# EAGLE design WeMos-Lora (EAGLE 7.7.0)
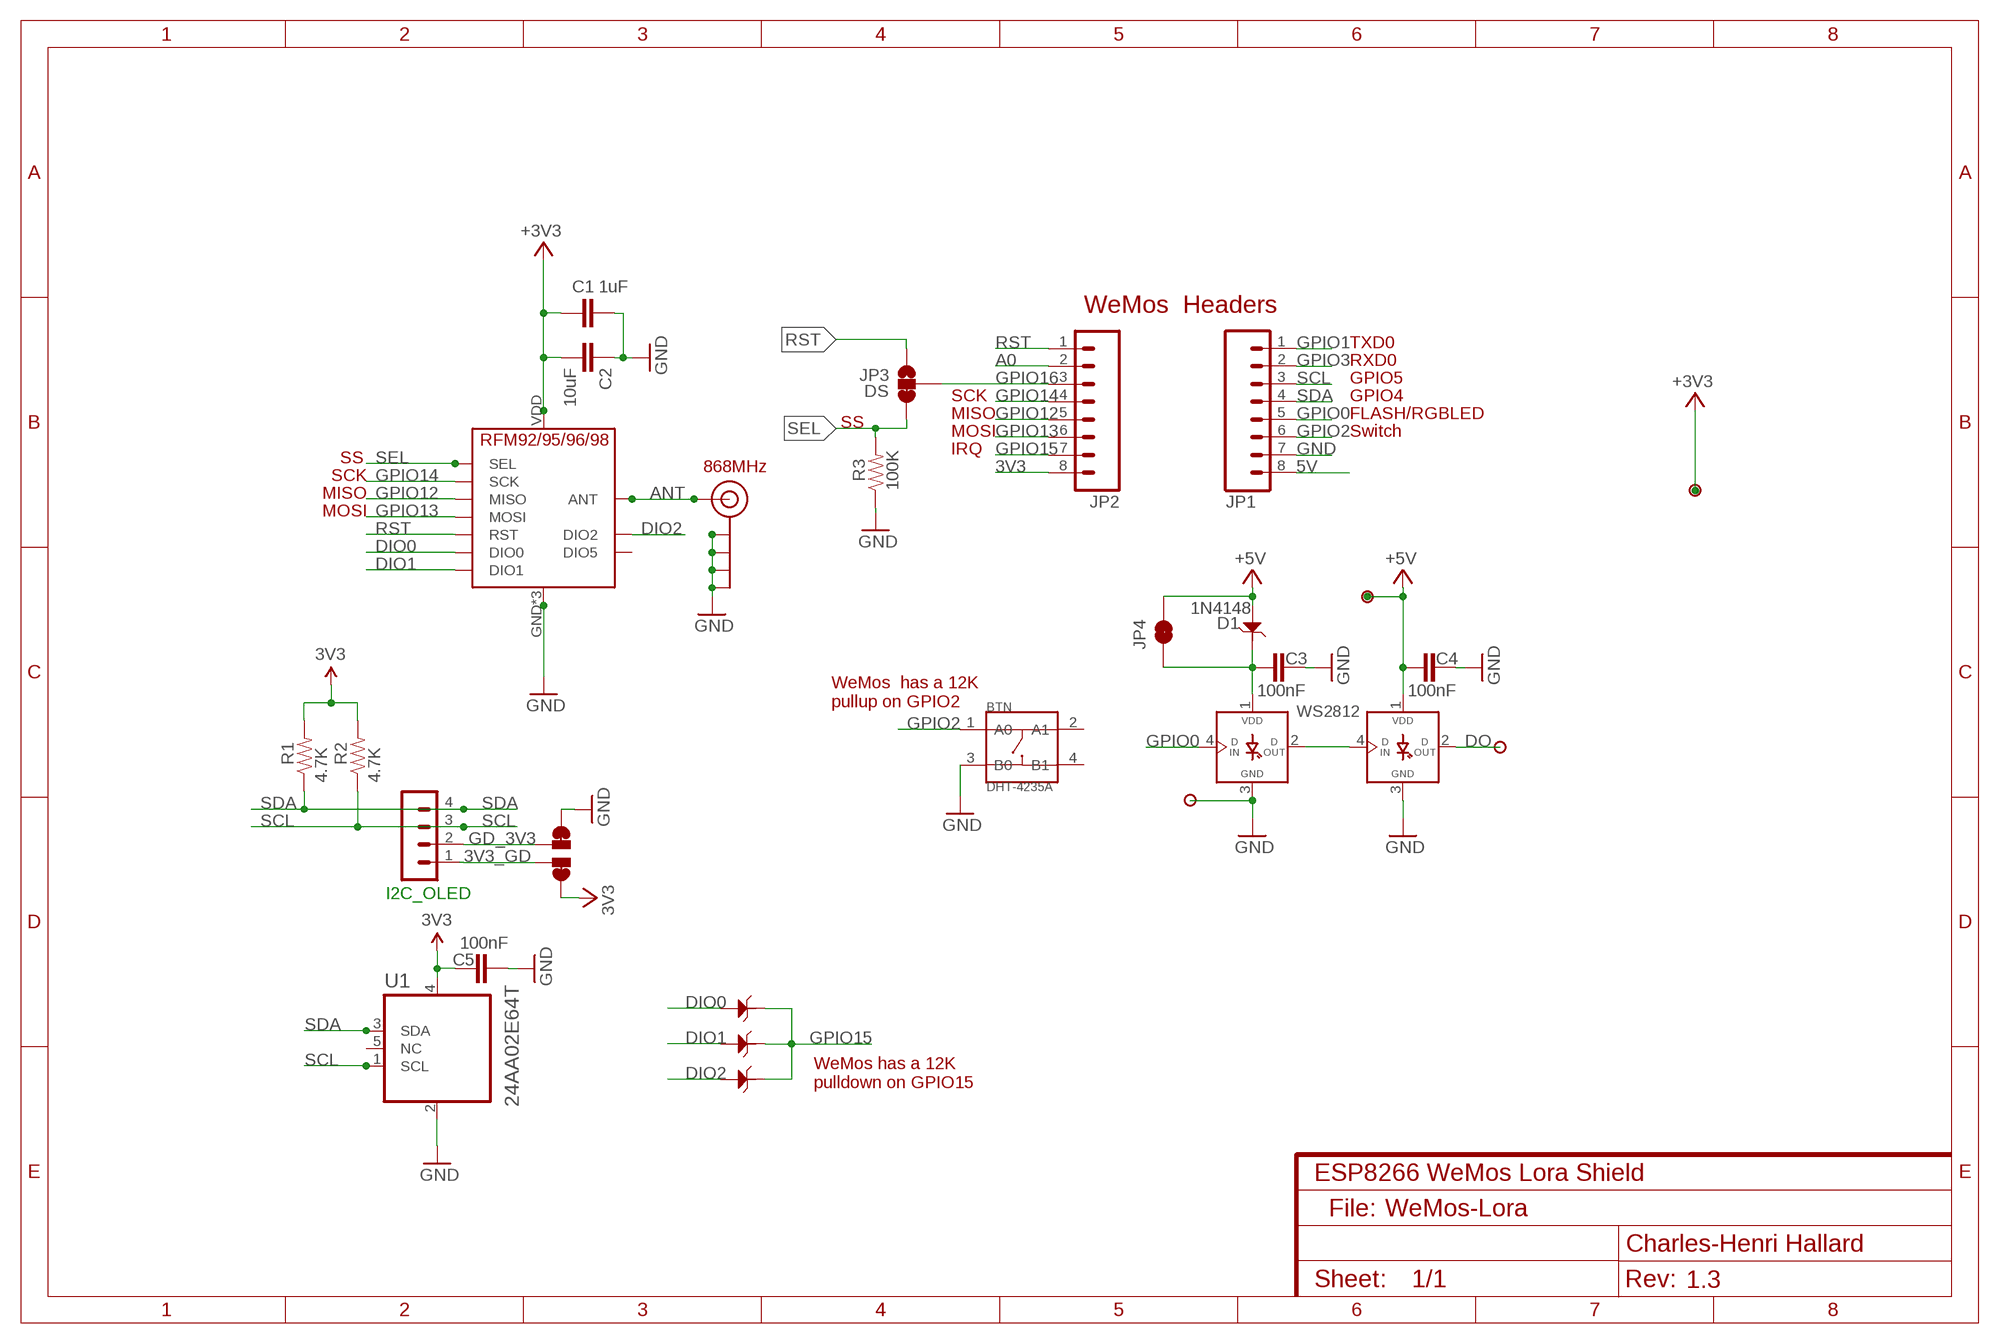
[diagram p0: schematic, sheet 1]
NAME (FRAME-A4L): CNAME: ESP8266 WeMos Lora Shield; CREVISION: 1.3; DESIGNER: Charles-Henri Hallard

## Parts
BTN  DHT-4235A  SMD-BUTTON-TOP-DHT-4235A(4P-4.2X3.2MM)  [SW4-SMD-4.2X3.2X2.5MM]
C1  1uF  CAP0805-CAP-LARGEPADS  [0805-CAP-LARGEPADS]
C2  10uF  CAP0805-CAP-LARGEPADS  [0805-CAP-LARGEPADS]
C3  100nF  CAP0805-CAP  [0805-CAP]
C4  100nF  CAP0805-CAP  [0805-CAP]
C5  100nF  CAP0805-CAP  [0805-CAP]
D1  1N4148  D-ESD-2P-CESD5V0D1  [SOD123-2.7X1.6]
D2  1N4148  D-ESD-2P-CESD5V0D1  [SOD123-2.7X1.6]
D3  1N4148  D-ESD-2P-CESD5V0D1  [SOD123-2.7X1.6]
D4  1N4148  D-ESD-2P-CESD5V0D1  [SOD123-2.7X1.6]
I2C_OLED  CON_HEADER_1X04'LOCK'  [1X04_LOCK]
J$2  ANTENNATINY  [SMA_UFL_PAD_TINY]
JP1  M08NO_SILK_FEMALE_PTH  [1X08_NO_SILK]
JP2  M08NO_SILK_FEMALE_PTH  [1X08_NO_SILK]
JP3  DS  JUMPER-PAD-3-2OF3_NC_BY_TRACE_SMALL  [PAD-JUMPER-3-2OF3_NC_BY_TRACE_YES_SILK_FULL_BOX]
JP4  JUMPER-PAD-2-NC_BY_TRACE  [PAD-JUMPER-2-NC_BY_TRACE_YES_SILK]
P1  PADNORMAL  [PAD]
P2  PADNORMAL  [PAD]
P3  PADNORMAL  [PAD]
P4  PADNORMAL  [PAD]
R1  4.7K  RESISTOR0805-RES  [0805-RES]
R2  4.7K  RESISTOR0805-RES  [0805-RES]
R3  100K  RESISTOR0805-RES  [0805-RES]
U1  24AA02E64T  24AA02E64T-I/OT  [SOT95P270X145-5N]
U$2  PAD-JUMPER-SWAPSWAP  [PAD-JUMPER-SWAP]
U$5  RFM95  [RFM95]
WS1  WS2812B  WS2812BSMD  [WS2812B]
WS2812  WS2812B  WS2812BSMD  [WS2812B]

## Nets
3V3: C1.2 C2.2 C5.1 JP2.8 P4.1 R1.2 R2.2 U1.4(VCC) U$2.4 U$2.44 U$5.VDD(VCC) ; supply symbol labelled +3V3
3V3_GD: I2C_OLED.1 U$2.3
5V: C4.1 D1.1 JP1.8 JP4.2 P1.1 WS1.1(VDD) ; supply symbol labelled +5V
A0: JP2.2
ANT: J$2.ANT1(SIGNAL) J$2.ANT2(SIGNAL) J$2.ANT3(SIGNAL) U$5.ANT
DIO0: D2.1 U$5.DIO0
DIO1: D3.1 U$5.DIO1
DIO2: D4.1 U$5.DIO2
DO: P2.1 WS1.2(DOUT)
GD_3V3: I2C_OLED.2 U$2.2
GND: BTN.3(B0) C1.1 C2.1 C3.2 C4.2 C5.2 J$2.GND1(GND) J$2.GND2(GND) J$2.GND3(GND) J$2.GND4(GND) JP1.7 P3.1 R3.1 U1.2(VSS) U$2.1 U$2.11 U$5.GND U$5.GND1(GND) U$5.GND2(GND) WS1.3(GND) WS2812.3(GND)
GPIO0: JP1.5 WS2812.4(DIN)
GPIO1: JP1.1
GPIO2: BTN.1(A0) JP1.6
GPIO3: JP1.2
GPIO12: JP2.5 U$5.MISO
GPIO13: JP2.6 U$5.MOSI
GPIO14: JP2.4 U$5.SCK
GPIO15: D2.2 D3.2 D4.2 JP2.7
GPIO16: JP2.3 JP3.2
N$1: WS1.4(DIN) WS2812.2(DOUT)
RST: JP2.1 JP3.1 U$5.RST
SCL: I2C_OLED.3 JP1.3 R2.1 U1.1(SCL)
SDA: I2C_OLED.4 JP1.4 R1.1 U1.3(SDA)
SEL: JP3.3 R3.2 U$5.NSS(SEL)
VLED: C3.1 D1.2 JP4.1 WS2812.1(VDD)
Unconnected: BTN.2(A1) BTN.4(B1) U1.5(NC) U$5.DIO5

## Notes on the sheet
- WeMos  Headers
- TXD0
- RXD0
- GPIO5
- SCK | GPIO4
- MISO | FLASH/RGBLED
- SS
- MOSI | Switch
- IRQ
- SS
- 868MHz
- SCK
- MISO
- MOSI
- WeMos  has a 12K
  pullup on GPIO2
- WeMos has a 12K
  pulldown on GPIO15
- File:

## Library data of the parts
BTN = Switch-2016:SMD-BUTTON-TOP-DHT-4235A(4P-4.2X3.2MM): 311020045; MPN: DHT-4235A
C1-C5 = _c2h:CAP: Capacitor Standard 0603 ceramic capacitor, and 0.1" leaded capacitor.
D1-D4 = Seeed-Discrete:D-ESD-2P: Diodes for Protectiong against ESD
I2C_OLED = _c2h:CON_HEADER_1X04
J$2 = _c2h:ANTENNA: SMA Antenna Connector End launch SMA connector. The paste layer has been removed so that the connector can be hand soldered onto the board after reflow.
JP1 JP2 = SparkFun-Connectors:M08: Header 8 Standard 8-pin 0.1" header. Use with straight break away headers (SKU : PRT-00116), right angle break away headers (PRT-00553), swiss pins (PRT-00743), machine pins (PRT-00117), and female headers (PRT-00115).; PROD_ID: CONN-08438
JP3 = _c2h:JUMPER-PAD-3-2OF3_NC_BY_TRACE
JP4 = SparkFun-Passives:JUMPER-PAD-2-NC_BY_TRACE
P1-P4 = _c2h:PAD
R1-R3 = _c2h:RESISTOR: Resistor Basic schematic elements and footprints for 0603, 1206, and PTH resistors.
U1 = Microchip-24AA02E64T:24AA02E64T-I/OT: 2K I2C™ Serial EEPROMs, SOT23-5; MPN: 24AA02E64T-I/OT; OC_FARNELL: 2345567; OC_NEWARK: 01X0461; PACKAGE: SOT23-5; SUPPLIER: Microchip
U$2 = _c2h:PAD-JUMPER-SWAP
U$5 = _c2h:RFM95
WS1 WS2812 = _c2h:WS2812B

## Net classes
0 default: width 0.203 mm, drill 0.356 mm, clearance 0.152 mm
1 power: width 0.203 mm, clearance 0.152 mm

## Board
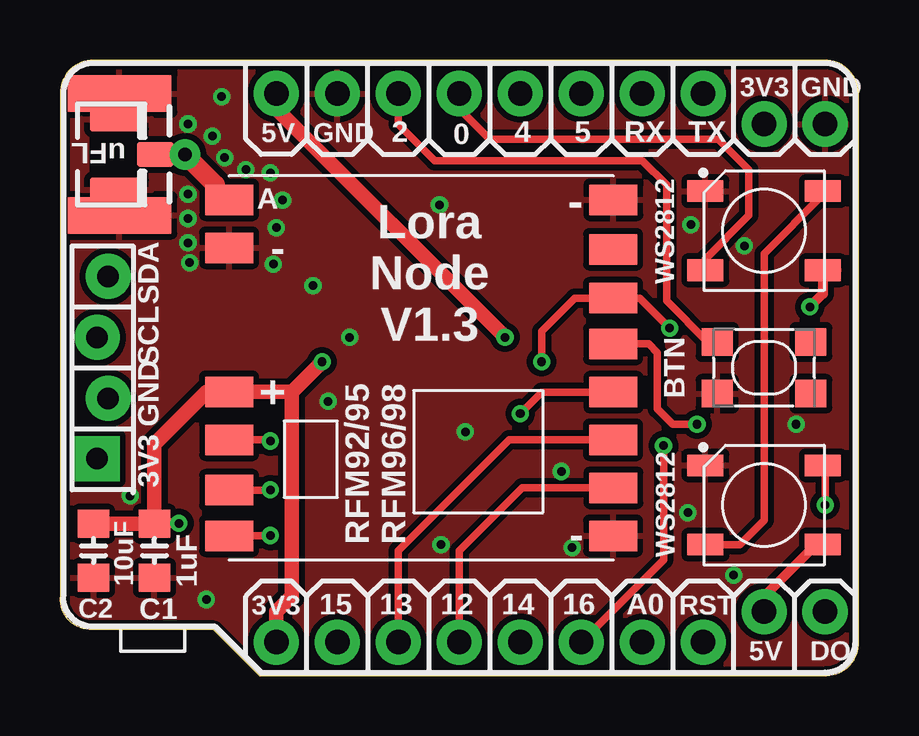
[diagram p1: board, top side]
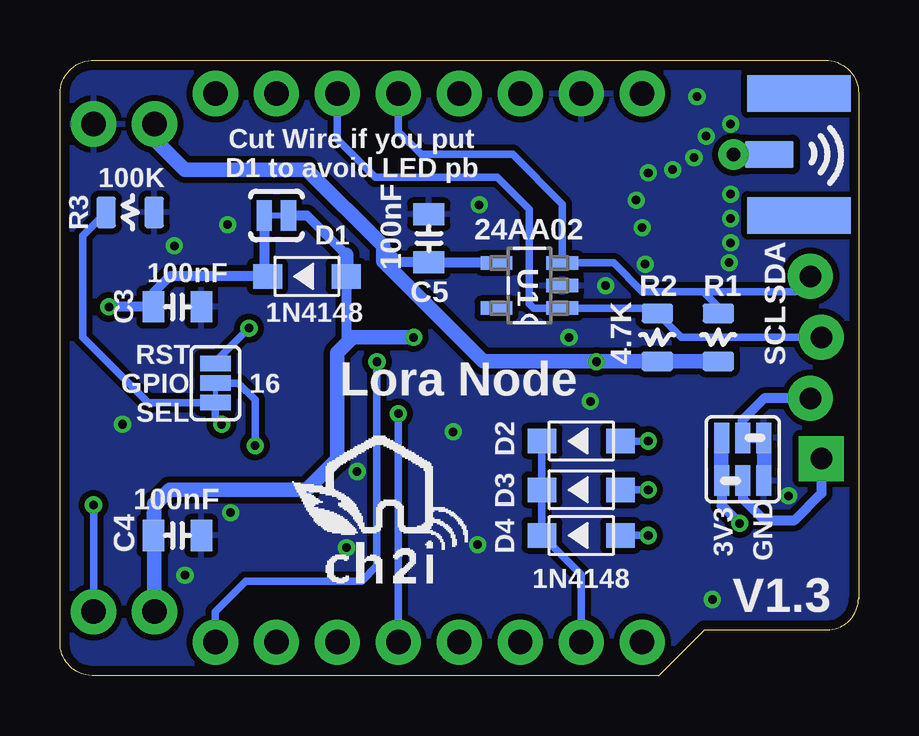
[diagram p2: board, bottom side, seen from below]

Size 33.27 x 25.65 mm. Coordinates in mm from the lower left corner, seen from the top.
Outline: 1.4,25.65 31.84,25.65 arc-90 33.27,24.26 33.27,1.4 arc-90 31.94,0 8.32,0 6.41,1.91 1.33,1.91 arc-90 0,3.24
Outline: 1.4,25.65 1.37,25.65
Outline: 0,3.24 0,24.26 arc-90 1.4,25.65
Outline: 0,3.24 0,3.17
Copper layers (1*16): Top 0.0356mm / dielectric 1.5011mm / Bottom 0.0356mm
Design rules "PCBs_io *": minimum track width 6mil, minimum drill 13mil, track to track 6mil, track to pad 6mil, pad to pad 6mil, via to via 6mil, smd to smd 6mil, copper to edge 15mil, drill to drill 6mil, minimum pad ring 7mil, minimum via ring 7mil, stop-mask expansion 3mil, vias tented up to drill 40mil, thermal gap 10mil

### Footprints (pad centres in the part's own frame; a part is rotated, then mirrored left to right if it is on the bottom)
SW4-SMD-4.2X3.2X2.5MM = smd 1.3 x 1.15: 1 -1.95,1.075; 2 1.95,1.075; 3 -1.95,-1.075; 4 1.95,-1.075
0805-CAP-LARGEPADS = smd 1.156 x 1.3: 1 -1.127,0; 2 1.127,0
0805-CAP = smd 0.902 x 1.3: 1 -1,0; 2 1,0
SOD123-2.7X1.6 = smd 1.2 x 1.02: 1 -1.635,0; 2 1.635,0
1X04_LOCK = drill 0.9 pad 1.88 square: 1 1.295,1.372 | drill 0.9 pad 1.88: 2 3.81,0.914; 3 6.35,1.372; 4 8.89,0.914
SMA_UFL_PAD_TINY = smd 1.524 x 1.016: ANT1 -3.843,0 | drill 0.559 pad 1.27: ANT2 -5.08,0 | smd 2.032 x 1.143 bottom: ANT3 -3.589,0 | smd 2.2 x 1.016: GND1 -2.223,1.47; GND2 -2.223,-1.47 | smd 4.318 x 1.524: GND3 -2.349,-2.54; GND4 -2.349,2.54 | smd 4.318 x 1.524 bottom: GND5 -2.349,2.54; GND6 -2.349,-2.54
1X08_NO_SILK = drill 1.016 pad 1.88: 1 0,0; 2 2.54,0; 3 5.08,0; 4 7.62,0; 5 10.16,0; 6 12.7,0; 7 15.24,0; 8 17.78,0
PAD-JUMPER-3-2OF3_NC_BY_TRACE_YES_SILK_FULL_BOX = smd 0.635 x 1.27: 1 -0.813,0; 2 0,0; 3 0.813,0
PAD-JUMPER-2-NC_BY_TRACE_YES_SILK = smd 0.635 x 1.27: 1 -0.508,0; 2 0.508,0
PAD = drill 1.016 pad 1.88: 1 0,0
0805-RES = smd 0.8 x 1.3: 1 -1,0; 2 1,0
SOT95P270X145-5N = smd 1.321 x 0.559: 1 -1.372,0.94; 2 -1.372,0; 3 -1.372,-0.94; 4 1.372,-0.94; 5 1.372,0.94
PAD-JUMPER-SWAP = smd 0.635 x 1.27: 1 -0.876,0.889; 2 0,-0.889; 3 0,0.889; 4 0.876,-0.889; 11 -0.876,-0.889; 44 0.876,0.889
RFM95 = smd 2 x 1.27: ANT 5.777,-7; DIO0 5.777,3; DIO1 5.779,5.095; DIO2 5.779,7; DIO5 -10.225,-4.936; GND 5.777,-5; GND1 -10.223,7; GND2 -10.23,-7; MISO -10.23,5; MOSI -10.225,3; NSS -10.223,-1; RST -10.223,-2.905; SCK -10.23,1.012; VDD 5.777,1
WS2812B = smd 1.5 x 0.9: 1 2.45,-1.65; 2 2.45,1.65; 3 -2.45,1.65; 4 -2.45,-1.65

### Placement (x,y rotation side)
BTN  29.34,12.83 0 top
C1  3.94,5.21 90 top
C2  1.4,5.21 90 top
C3  28.38,15.37 0 bottom
C4  28.38,5.84 0 bottom
C5  17.91,18.22 90 bottom
D1  22.99,16.64 180 bottom
D2  11.56,9.78 180 bottom
D3  11.56,7.75 180 bottom
D4  11.56,5.84 180 bottom
I2C_OLED  2.92,7.75 90 top
J$2  0.13,21.72 180 top
JP1  26.8,24.26 180 top
JP2  26.8,1.4 180 top
JP3  26.8,12.19 270 bottom
JP4  24.26,19.18 0 bottom
P1  29.34,2.67 0 top
P2  31.88,2.67 0 top
P3  31.88,22.99 0 top
P4  29.34,22.99 0 top
R1  5.84,14.1 270 bottom
R2  8.38,14.1 270 bottom
R3  30.35,19.3 180 bottom
U1  13.72,16.26 180 bottom
U$2  4.83,9.02 180 bottom
U$4  [LOGO_CH2I_75MM]  19.49,5.84 0 bottom
U$5  12.83,12.83 180 top
WS1  29.34,7.11 0 top
WS2812  29.34,18.54 0 top

### Tracks (layer width: path | path; a pad name or v marks a point on that pad's centre or on a via)
3V3  (via drill 0.36 pad 0.71)
  Top 0.406: v4.95,6.35 3.95,6.35 C1.2
  Top 0.61: JP2.8 9.02,2.67 9.65,3.3 9.65,11.81 9.67,11.83 | 9.67,11.83 U$5.VDD 6.11,11.83 3.94,9.65 C1.2 C2.2 | 9.67,11.83 v10.92,13.08
  Bottom 0.406: U1.4 17.88,17.2 C5.1 19.13,17.22 19.81,17.91 | v4.95,6.35 5.7,7.1 U$2.44 U$2.4
  Bottom 0.61: v10.92,13.08 9.29,13.1 R1.2 R2.2 15.64,13.1 19.81,17.27 19.81,17.91 22.99,21.08 28.07,21.08 29.34,22.35 P4.1
3V3_GD
  Bottom 0.406: U$2.3 4.83,7.37 3.94,6.48 2.67,6.48 1.55,7.59 I2C_OLED.1
5V  (via drill 0.36 pad 0.71)
  Top 0.406: 31.5,5.46 29.34,3.3 P1.1
  Top 0.61: v18.54,14.1 9.02,23.62 JP1.8 | WS1.1 31.5,5.46
  Bottom 0.406: D1.1 21.35,13.83 | JP4.2 22.99,19.18 21.35,17.54
  Bottom 0.61: v18.54,14.1 21.08,14.1 21.35,13.83 21.72,13.46 21.72,9.02 22.99,7.75 28.7,7.75 29.29,7.16 29.34,7.16 C4.1 29.34,7.06 P1.1 | D1.1 21.35,17.54
ANT
  Top 0.61: U$5.ANT 6.46,19.83 | J$2.ANT1 J$2.ANT2
  Top 0.813: 6.46,19.83 6.46,20.46 J$2.ANT2
  Bottom 0.61: J$2.ANT3 J$2.ANT2
DIO0  (via drill 0.36 pad 0.61)
  Top 0.305: U$5.DIO0 8.71,9.83 v8.76,9.78
  Bottom 0.305: D2.1 v8.76,9.78
DIO1  (via drill 0.36 pad 0.61)
  Top 0.305: 7.03,7.75 U$5.DIO1 8.75,7.73 v8.76,7.75
  Bottom 0.305: D3.1 v8.76,7.75
DIO2  (via drill 0.36 pad 0.61)
  Top 0.305: U$5.DIO2 8.75,5.83 v8.76,5.84
  Bottom 0.305: D4.1 v8.76,5.84
DO  (via drill 0.36 pad 0.71)
  Top 0.305: v31.88,7.11 31.88,8.67 WS1.2
  Bottom 0.305: P2.1 v31.88,7.11
GD_3V3
  Bottom 0.406: I2C_OLED.2 3.94,11.56 4.83,10.67 U$2.2
GND  (via drill 0.36 pad 0.71)
  Bottom 0.406: U$2.11 U$2.1
  other vias: 28.07,4.19 30.67,10.48 6.1,3.17 6.73,24.13 11.18,11.43 10.54,16.26 9.27,19.81 8.89,17.14 6.35,22.48 6.86,21.59 5.33,20.07 5.33,19.05 5.33,18.03 5.33,22.99 15.87,5.46 26.16,6.79 21.34,5.33 26.29,18.8 16.89,10.16 7.75,21.08 8.76,20.95 9.02,18.67 5.4,17.21 28.51,17.91 15.81,19.62 20.89,8.51 2.92,7.49 12.06,14.1
  pour Bottom (isolate 0.254): 34.42,26.8 34.42,-1.14 -1.14,-1.14 -1.14,26.8
  pour Top (isolate 0.254): -0.51,26.16 33.78,26.16 33.78,-0.51 -0.51,-0.51
GPIO0
  Top 0.305: JP1.5 16.64,23.62 17.91,22.35 27.43,22.35 28.7,21.08 28.7,19.18 26.89,17.36 WS2812.4
GPIO2
  Top 0.305: BTN.1 26.99,13.9 25.27,15.62 25.27,20.45 24.26,21.46 15.62,21.46 14.1,22.99 JP1.6
GPIO12
  Top 0.305: JP2.5 16.64,5.21 19.26,7.83 U$5.MISO
GPIO13
  Top 0.305: JP2.6 14.1,5.21 18.72,9.83 U$5.MOSI
GPIO14  (via drill 0.36 pad 0.71)
  Top 0.305: U$5.SCK 20.07,11.82 v19.18,10.92
  Bottom 0.305: v19.18,10.92 JP2.4
GPIO15
  Bottom 0.305: D2.2 D3.2 D4.2 11.56,4.21 JP2.7
GPIO16  (via drill 0.36 pad 0.71)
  Top 0.305: JP2.3 25.15,4.83 v25.15,9.59
  Bottom 0.305: 26.54,12.13 JP3.2 25.84,12.19 25.15,11.49 v25.15,9.59
N$1
  Top 0.305: WS1.4 28.32,5.46 29.34,6.48 29.34,17.59 31.79,20.04 WS2812.2
RST  (via drill 0.36 pad 0.61, 0.36 pad 0.71)
  Top 0.305: v20.07,13.08 20.07,14.35 21.45,15.73 U$5.RST 24.15,15.73 v25.4,14.48
  Bottom 0.305: v20.07,13.08 20.07,4.57 20.7,3.94 25.53,3.94 26.8,2.67 JP2.1 | JP3.1 26.8,13.08 v25.4,14.48
SCL
  Bottom 0.305: I2C_OLED.3 7.38,14.1 R2.1 8.6,15.32 U1.1 13.54,15.32 13.72,15.49 13.72,19.43 15.05,20.76 20.13,20.76 21.72,22.35 JP1.3
SDA
  Bottom 0.305: 6.48,16 9.02,16 10.21,17.2 U1.3 12.34,19.65 14.41,21.72 18.23,21.72 19.18,22.67 JP1.4 | 6.48,16 2.67,16 2.03,16.64 I2C_OLED.4 | R1.1 5.84,15.37 6.48,16
SEL  (via drill 0.36 pad 0.71)
  Top 0.305: U$5.NSS 24.53,13.83 24.89,13.46 24.89,11.11 25.53,10.48 v26.54,10.48
  Bottom 0.305: R3.2 32.32,18.34 32.32,14.1 29.6,11.38 JP3.3 26.8,10.73 v26.54,10.48
VLED  (via drill 0.36 pad 0.71)
  Top 0.406: WS2812.1 31.79,15.91 v31.24,15.37
  Top 0.61: WS2812.1 32.26,16.89
  Bottom 0.406: D1.2 28.7,16.64 29.34,16 29.34,15.41 | C3.1 v31.24,15.37 | JP4.1 24.77,16.78
  Bottom 0.61: 29.34,15.41 C3.1 | 24.77,16.78 D1.2

### Text on the board
tNames: 3V3 | GND | 5V | GND | 2 | 0 | 4 | 5 | RX | TX | Lora / Node / V1.3 | SDA | SCL | GND | 3V3 | WS2812 | RFM92/95 / RFM96/98 | 3V3 | 15 | 13 | 12 | 14 | 16 | A0 | RST | 5V | DO
bNames: Cut Wire if you put / D1 to avoid LED pb | 24AA02 | SDA | SCL | RST | Lora Node | 16 | GPIO | SEL | GND | 3V3 | V1.3